# Altium schematic sheet TemSensor&CON.SchDoc
size A4; Revision: B.2
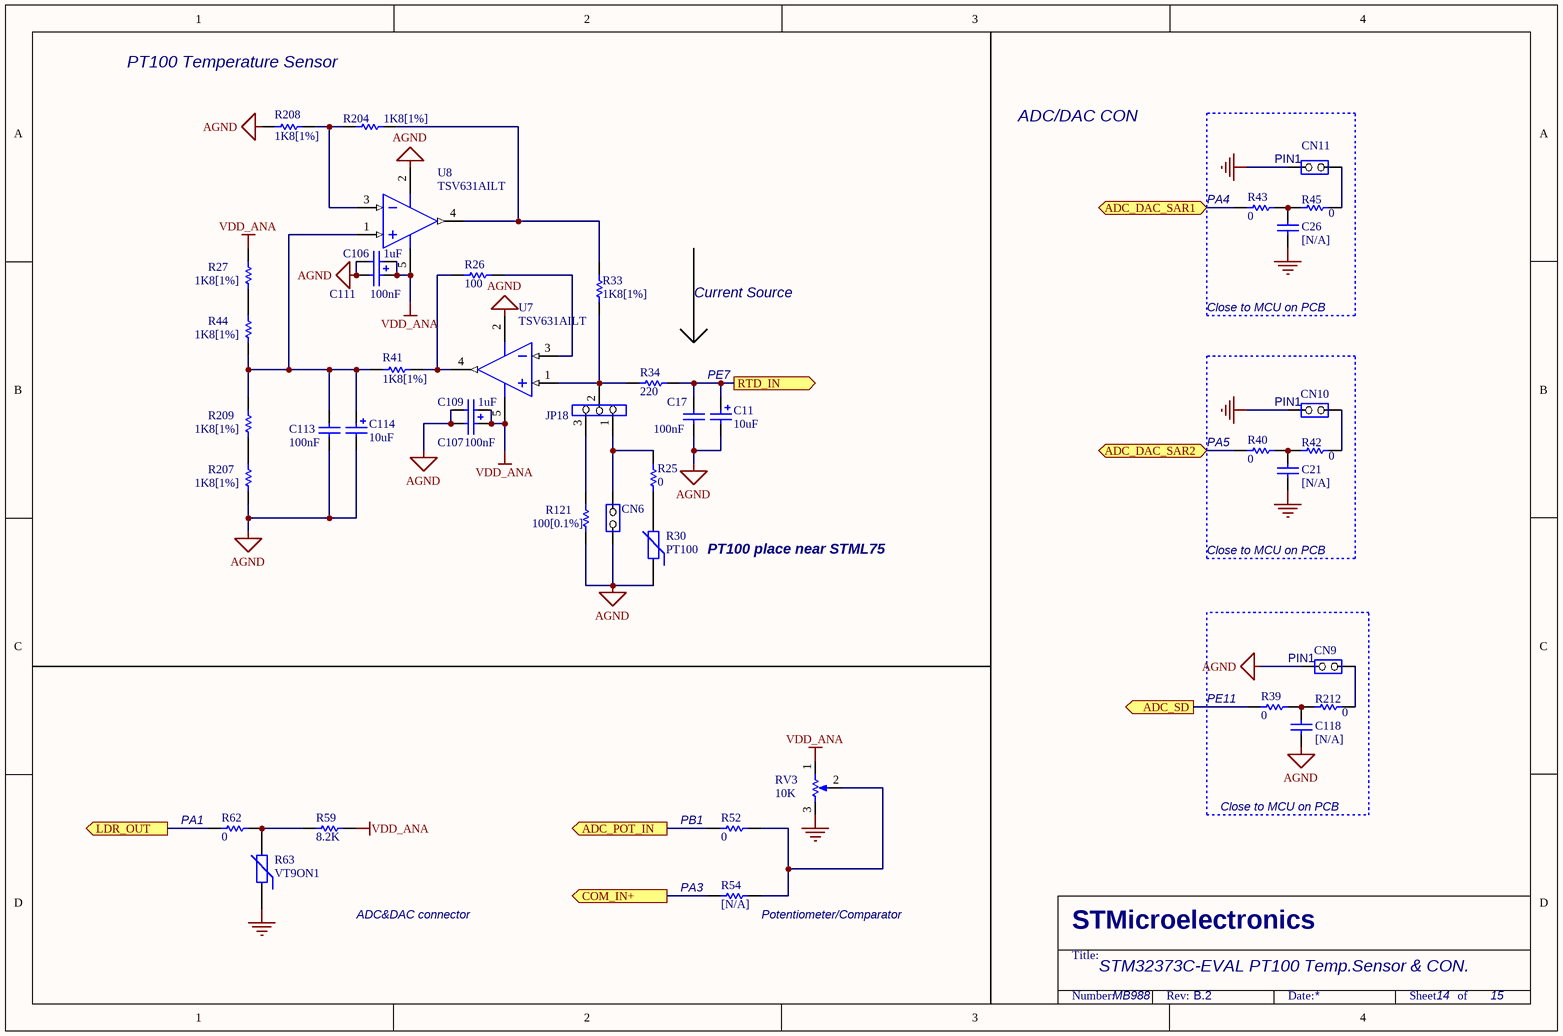
[diagram p0: TemSensor&CON.SchDoc]

## Parts
C11  10uF  [TAN-A]
C17  100nF  [0603C]
C21  [N/A]  [0603C]
C26  [N/A]  [0603C]
C106  1uF  [TAN-A]
C107  100nF  [0603C]
C109  1uF  [TAN-A]
C111  100nF  [0603C]
C113  100nF  [0603C]
C114  10uF  [TAN-A]
C118  [N/A]  [0603C]
CN6  (no value)  [SIP2]
CN9  (no value)  [SIP2]
CN10  (no value)  [SIP2]
CN11  (no value)  [SIP2]
JP18  (no value)  [SIP3]
R25  0  [0603R]
R26  100  [0603R]
R27  1K8[1%]  [0603R]
R30  PT100  [0805R]
R33  1K8[1%]  [0603R]
R34  220  [0603R]
R39  0  [0603R]
R40  0  [0603R]
R41  1K8[1%]  [0603R]
R42  0  [0603R]
R43  0  [0603R]
R44  1K8[1%]  [0603R]
R45  0  [0603R]
R52  0  [0603R]
R54  [N/A]  [0603R]
R59  8.2K  [0603R]
R62  0  [0603R]
R63  VT9ON1  [PVT901]
R121  100[0.1%]  [0603R]
R204  1K8[1%]  [0603R]
R207  1K8[1%]  [0603R]
R208  1K8[1%]  [0603R]
R209  1K8[1%]  [0603R]
R212  0  [0603R]
RV3  10K  [3296W]
U7  TSV631AILT  [SOT-23-5L]
U8  TSV631AILT  [SOT-23-5L]

## Ports
ADC_DAC_SAR1 (bidir), ADC_DAC_SAR2 (bidir), ADC_POT_IN (out), ADC_SD (out), COM_IN+ (out), LDR_OUT (out), RTD_IN (out)

## Nets
AGND: C11.2 C17.1 C106.2 C107.1 C109.2 C111.1 C113.1 C114.2 C118.1 CN6.2(NO) CN9.1(COMMON) R30.1 R121.2 R207.2 R208.1 U7.2(VDD) U8.2(VDD)
GND: C21.1 C26.1 CN10.1(COMMON) CN11.1(COMMON) R63.1 RV3.3(TOP)
VDD_ANA: C106.1 C107.2 C109.1 C111.2 R27.1 R59.2 RV3.1(BOT) U7.5(VCC) U8.5(VCC)
ADC_DAC_SAR1: R43.1 ; port ADC_DAC_SAR1
ADC_DAC_SAR2: R40.1 ; port ADC_DAC_SAR2
ADC_POT_IN: R52.1 ; port ADC_POT_IN
ADC_SD: R39.1 ; port ADC_SD
COM_IN+: R54.1 ; port COM_IN+
LDR_OUT: R62.2 ; port LDR_OUT
RTD_IN: C11.1 C17.2 R34.1 ; port RTD_IN
NetC21_2: C21.2 R40.2 R42.1
NetC26_2: C26.2 R43.2 R45.1
NetC113_2: C113.2 C114.1 R41.1 R44.2 R209.1 U8.1(IN+)
NetC118_2: C118.2 R39.2 R212.1
NetCN6_1: CN6.1(COMMON) JP18.1 R25.1
NetCN9_2: CN9.2(NO) R212.2
NetCN10_2: CN10.2(NO) R42.2
NetCN11_2: CN11.2(NO) R45.2
NetJP18_2: JP18.2 R33.2 R34.2 U7.1(IN+)
NetJP18_3: JP18.3 R121.1
NetR25_2: R25.2 R30.2
NetR26_1: R26.1 U7.3(IN-)
NetR26_2: R26.2 R41.2 U7.4(OUT)
NetR27_2: R27.2 R44.1
NetR33_1: R33.1 R204.2 U8.4(OUT)
NetR52_2: R52.2 R54.2 RV3.2(TAP)
NetR59_1: R59.1 R62.1 R63.2
NetR204_1: R204.1 R208.2 U8.3(IN-)
NetR207_1: R207.1 R209.2

## Notes on the sheet
- PT100 Temperature Sensor
- ADC/DAC CON
- (near CN11) PIN1
- (near R43) PA4
- Current Source
- Close to MCU on PCB
- PE7
- (near R40) PA5
- (near CN10) PIN1
- PT100 place near STML75
- (near R39) PE11
- (near CN9) PIN1
- (near R62) PA1
- (near R52) PB1
- ADC&DAC connector
- (near R54) PA3
- (near R54) Potentiometer/Comparator
- STM32373C-EVAL PT100 Temp.Sensor & CON.
- MB988
- 14
- 15
- STMicroelectronics
- Title:
- Number:
- Rev:
- Date:
- Sheet       of

## Library data of the parts
C11 C114 = Cap Pol1: Polarized Capacitor (Radial); Published: 8-Jun-2000; Revision: July-2002: Re-released for DXP Platform.; Publisher: Altium Limited; Value: 10uF
C17 C107 C111 C113 = CAP: Capacitor; Value: 100pF; Published: 8-Jun-2000; Revision: July-2002: Re-released for DXP Platform.; Publisher: Altium Limited
C21 C26 C118 = cap: Capacitor; Value: 100pF; Published: 8-Jun-2000; Revision: July-2002: Re-released for DXP Platform.; Publisher: Altium Limited
C106 C109 = Cap Pol1: Polarized Capacitor (Radial); Value: 10uF; Published: 8-Jun-2000; Revision: July-2002: Re-released for DXP Platform.; Publisher: Altium Limited
CN6 CN9-CN11 = JP2
JP18 = Jumper3
R25-R27 R33 R34 R39-R45 R52 R54 R59 R62 R121 R204 R207-R209 R212 = Res1: Resistor; Value: 1K; Published: 8-Jun-2000; Revision: July-2002: Re-released for DXP Platform.; Publisher: Altium Limited
R30 = PT100: Varistor (Voltage-Sensitive Resistor); Published: 24-Mar-1999; Revision: July-2002: Re-released for DXP Platform.; Publisher: Altium Limited
R63 = Res Varistor: Varistor (Voltage-Sensitive Resistor); Published: 24-Mar-1999; Revision: July-2002: Re-released for DXP Platform.; Publisher: Altium Limited
RV3 = RV